# EAGLE design Adafruit ESP32-S3 TFT Feather (EAGLE 9.6.2)
COMPANY: ADAFRUIT INDUSTRIES; DRAWN: KTOWN; REV: B
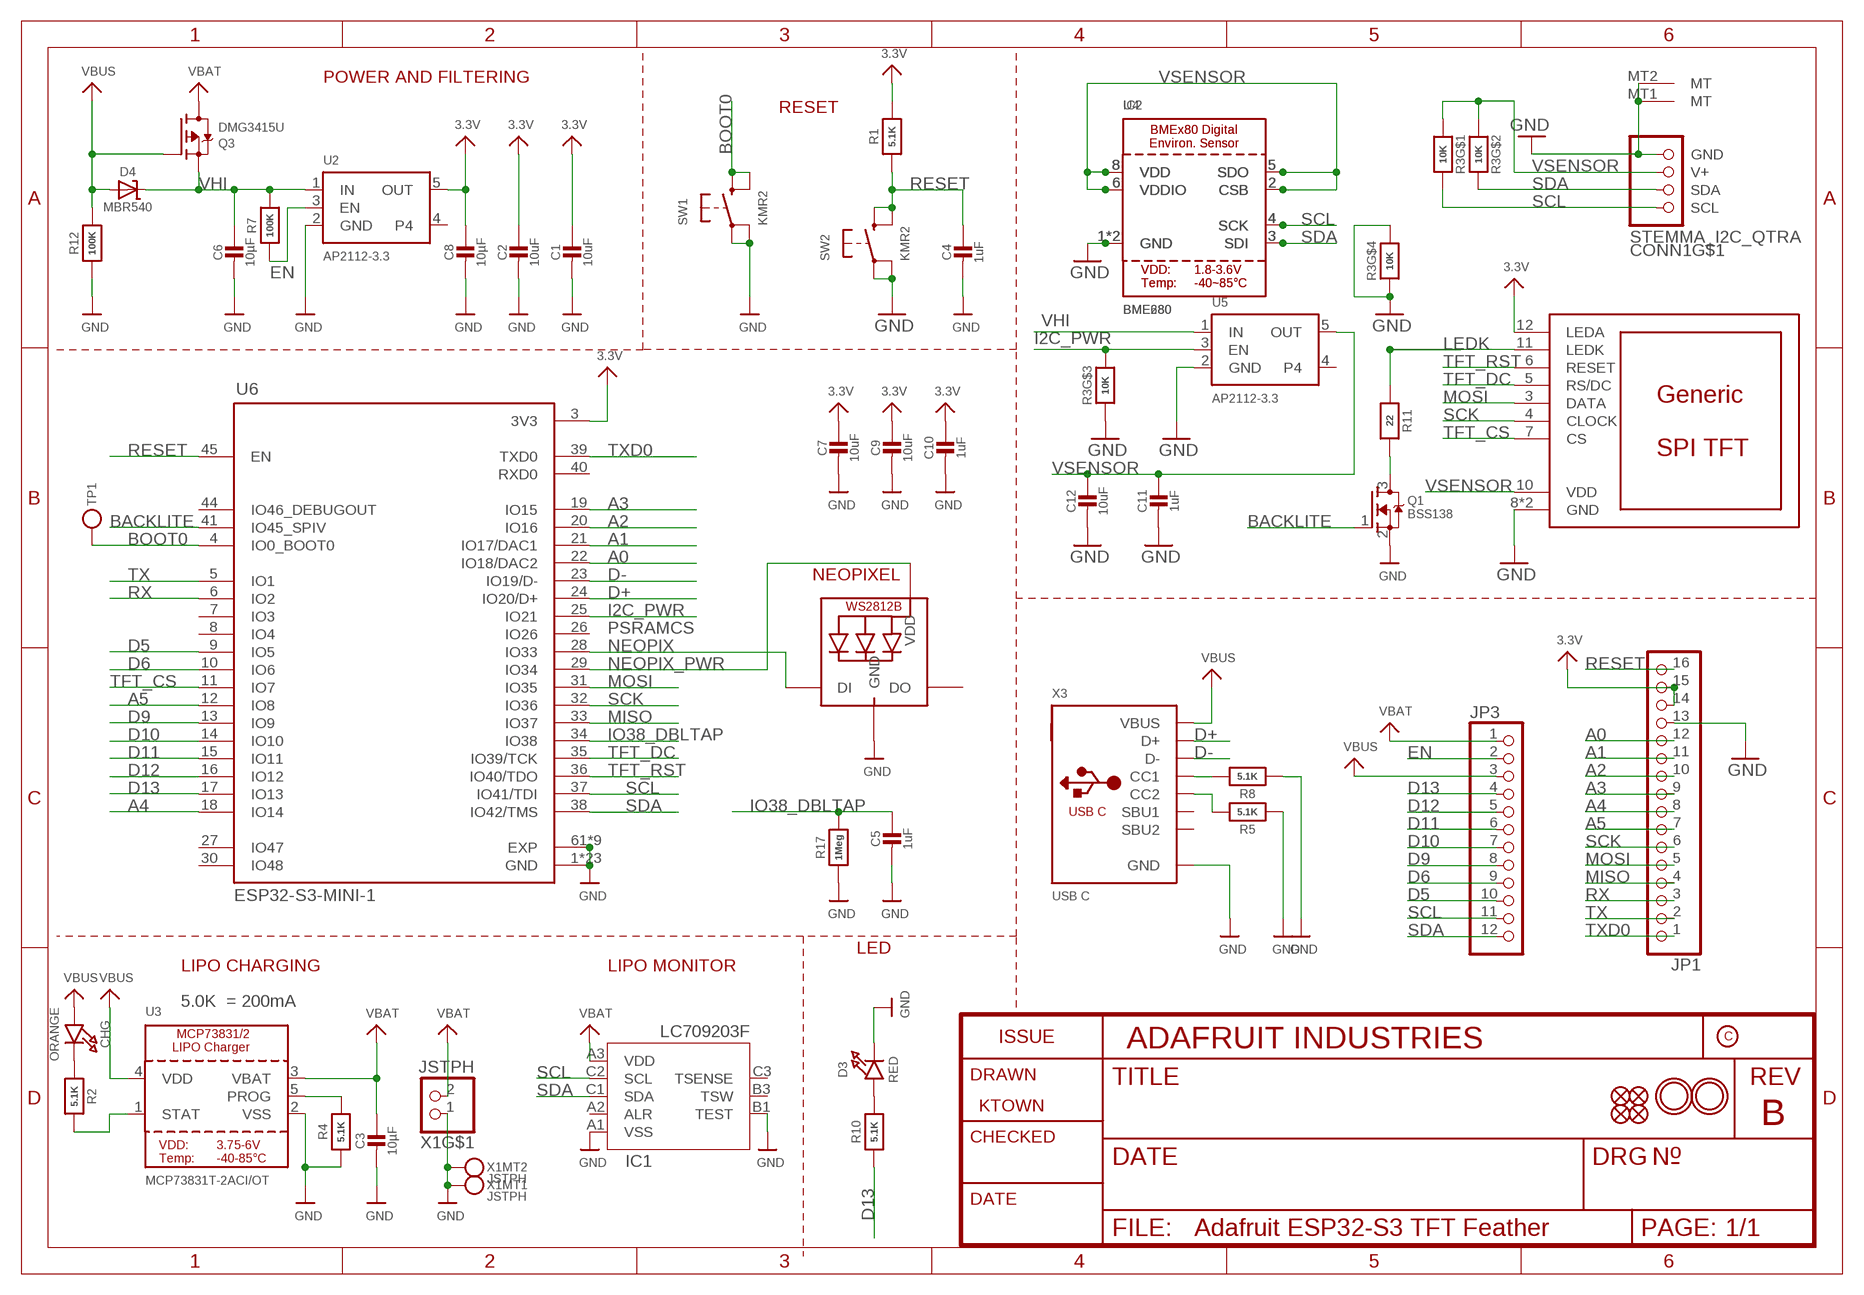
[diagram p0: schematic, sheet 1]

## Parts
C1  10uF  CAP_CERAMIC0805-NOOUTLINE  [0805-NO]
C2  10uF  CAP_CERAMIC0805-NOOUTLINE  [0805-NO]
C3  10µF  CAP_CERAMIC0805-NOOUTLINE  [0805-NO]
C4  1uF  CAP_CERAMIC0603_NO  [0603-NO]
C5  1uF  CAP_CERAMIC0603_NO  [0603-NO]
C6  10µF  CAP_CERAMIC0805-NOOUTLINE  [0805-NO]
C7  10uF  CAP_CERAMIC0805-NOOUTLINE  [0805-NO]
C8  10µF  CAP_CERAMIC0805-NOOUTLINE  [0805-NO]
C9  10uF  CAP_CERAMIC0805-NOOUTLINE  [0805-NO]
C10  1uF  CAP_CERAMIC0603_NO  [0603-NO]
C11  1uF  CAP_CERAMIC0603_NO  [0603-NO]
C12  10uF  CAP_CERAMIC0805-NOOUTLINE  [0805-NO]
CHG  ORANGE  LED0603_NOOUTLINE  [CHIPLED_0603_NOOUTLINE]
CONN1  STEMMA_I2C_QTRA  [JST_SH4_RA]
D3  RED  LED0603_NOOUTLINE  [CHIPLED_0603_NOOUTLINE]
D4  MBR540  DIODE-SCHOTTKYSOD-123  [SOD-123]
DISP1  DISP_LCD_GENERIC_SPI_1.14IN_240X135_WRAPUNDER  [TFT_1.14IN_240X135_WRAPUNDER]
IC1  LC709203F/MH  [WLCSP9]
IC2  BME680  [BME680]
JP1  HEADER-1X16_MIN  [1X16_ROUND_MIN]
JP3  HEADER-1X12_MIN  [1X12_ROUND_MIN]
LED1  WS2812B_SK6805_1515  [SK6805_1515]
Q1  BSS138  MOSFET-NREFLOW  [SOT23-R]
Q3  DMG3415U  MOSFET-P  [SOT23-R]
R1  5.1K  RESISTOR_0603_NOOUT  [0603-NO]
R2  5.1K  RESISTOR_0603_NOOUT  [0603-NO]
R3  10K  RESISTOR_4PACK  [RESPACK_4X0603]
R4  5.1K  RESISTOR_0603_NOOUT  [0603-NO]
R5  5.1K  RESISTOR_0603_NOOUT  [0603-NO]
R7  100K  RESISTOR_0603_NOOUT  [0603-NO]
R8  5.1K  RESISTOR_0603_NOOUT  [0603-NO]
R10  5.1K  RESISTOR_0603_NOOUT  [0603-NO]
R11  22  RESISTOR_0603_NOOUT  [0603-NO]
R12  100K  RESISTOR_0603_NOOUT  [0603-NO]
R17  1Meg  RESISTOR_0603_NOOUT  [0603-NO]
SW1  KMR2  SWITCH_TACT_SMT4.6X2.8  [BTN_KMR2_4.6X2.8]
SW2  KMR2  SWITCH_TACT_SMT4.6X2.8  [BTN_KMR2_4.6X2.8]
TP1  TESTPOINTROUND1.5MMNO  [TESTPOINT_ROUND_1.5MM_NO]
U2  AP2112-3.3  VREG_SOT23-5  [SOT23-5]
U3  MCP73831T-2ACI/OT  MCP73831/2  [SOT23-5]
U4  BME280  [BME280]
U5  AP2112-3.3  VREG_SOT23-5  [SOT23-5]
U6  ESP32-S3-MINI-1  [QFN60_ESP32-S2-MINI-1_EXP]
U$31  MOUNTINGHOLE2.5  [MOUNTINGHOLE_2.5_PLATED]
U$32  MOUNTINGHOLE2.5  [MOUNTINGHOLE_2.5_PLATED]
U$34  FIDUCIAL_1MM  [FIDUCIAL_1MM]
U$35  FIDUCIAL_1MM  [FIDUCIAL_1MM]
U$55  FIDUCIAL_1MM  [FIDUCIAL_1MM]
U$56  FIDUCIAL_1MM  [FIDUCIAL_1MM]
X1  JSTPH  CON_JST_PH_2PIN_MT_BATT  [JSTPH2_BATT]
X3  USB C  USB_C  [USB_C_CUSB31-CFM2AX-01-X]

## Nets
3.3V [power]: C1.1 C2.1 C7.1 C8.1 C9.1 C10.1 DISP1.12(LEDA) JP1.14 JP1.15 R1.2 U2.5(OUT) U6.3(3V3)
A0: JP1.12 U6.22(IO18/DAC2)
A1: JP1.11 U6.21(IO17/DAC1)
A2: JP1.10 U6.20(IO16)
A3: JP1.9 U6.19(IO15)
A4: JP1.8 U6.18(IO14)
A5: JP1.7 U6.12(IO8)
BACKLITE: Q1.1(G) U6.41(IO45_SPIV)
BOOT0: SW1.B'(S1) SW1.B(S) TP1.P$1 U6.4(IO0_BOOT0)
D5: JP3.10 U6.9(IO5)
D6: JP3.9 U6.10(IO6)
D9: JP3.8 U6.13(IO9)
D10: JP3.7 U6.14(IO10)
D11: JP3.6 U6.15(IO11)
D12: JP3.5 U6.16(IO12)
D13: JP3.4 R10.1 U6.17(IO13)
D+: U6.24(IO20/D+) X3.A6(D+) X3.B6(D+)
D-: U6.23(IO19/D-) X3.A7(D-) X3.B7(D-)
EN: JP3.2 R7.1 U2.3(EN)
GND: C1.2 C2.2 C3.2 C4.2 C5.2 C6.2 C7.2 C8.2 C9.2 C10.2 C11.2 C12.2 CONN1.1(GND) CONN1.MT1(MT) CONN1.MT2(MT) D3.C DISP1.8(GND) DISP1.13(GND) IC1.A1(VSS) IC1.B1(TEST) IC2.1(GND) IC2.7(GND) JP1.13 LED1.4(GND) Q1.2(S) R3.3 R3.4 R3.5 R4.1 R5.1 R8.1 R12.1 R17.1 SW1.A'(P1) SW1.A(P) SW2.A'(P1) SW2.A(P) U2.2(GND) U3.2(VSS) U4.1(GND) U4.7(GND) U5.2(GND) U6.1(GND) U6.2(GND) U6.42(GND) U6.43(GND) U6.46(GND) U6.47(GND) U6.48(GND) U6.49(GND) U6.50(GND) U6.51(GND) U6.52(GND) U6.53(GND) U6.54(GND) U6.55(GND) U6.56(GND) U6.57(GND) U6.58(GND) U6.59(GND) U6.60(GND) U6.61(EXP) U6.62(GND) U6.63(GND) U6.64(GND) U6.65(GND) U6.66(EXP) U6.67(EXP) U6.68(EXP) U6.69(EXP) U6.70(EXP) U6.71(EXP) U6.72(EXP) U6.73(EXP) X1.1 X1.NC1 X1.NC2 X3.A1B12(GND) X3.B1A12(GND)
I2C_PWR: R3.6 U5.3(EN) U6.25(IO21)
IO38_DBLTAP: C5.1 R17.2 U6.34(IO38)
LEDK: DISP1.11(LEDK) R11.1
MISO: JP1.4 U6.33(IO37)
MOSI: DISP1.3(DATA) JP1.5 U6.31(IO35)
N$1: CHG.C R2.1
N$2: Q1.3(D) R11.2
N$3: R2.2 U3.1(STAT)
N$4: R4.2 U3.5(PROG)
N$5: D3.A R10.2
N$8: R8.2 X3.A5(CC1)
N$9: R5.2 X3.B5(CC2)
NEOPIX: LED1.1(DI) U6.28(IO33)
NEOPIX_PWR: LED1.2(VDD) U6.29(IO34)
RESET: C4.1 JP1.16 R1.1 SW2.B'(S1) SW2.B(S) U6.45(EN)
RX: JP1.3 U6.6(IO2)
SCK: DISP1.4(CLOCK) JP1.6 U6.32(IO36)
SCL: CONN1.4(SCL) IC1.C2(SCL) IC2.4(SCK) JP3.11 R3.8 U4.4(SCK) U6.37(IO41/TDI)
SDA: CONN1.3(SDA) IC1.C1(SDA) IC2.3(SDI) JP3.12 R3.7 U4.3(SDI) U6.38(IO42/TMS)
TFT_CS: DISP1.7(CS) U6.11(IO7)
TFT_DC: DISP1.5(RS/DC) U6.35(IO39/TCK)
TFT_RST: DISP1.6(RESET) U6.36(IO40/TDO)
TX: JP1.2 U6.5(IO1)
TXD0: JP1.1 U6.39(TXD0)
VBAT [power]: C3.1 IC1.A3(VDD) JP3.1 Q3.3(D) U3.3(VBAT) X1.2
VBUS [power]: CHG.A D4.A JP3.3 Q3.1(G) R12.2 U3.4(VDD) X3.A4B9(VBUS) X3.B4A9(VBUS)
VHI [power]: C6.1 D4.C Q3.2(S) R7.2 U2.1(IN) U5.1(IN)
VSENSOR [power]: C11.1 C12.1 CONN1.2(V+) DISP1.10(VDD) IC2.2(CSB) IC2.5(SDO) IC2.6(VDDIO) IC2.8(VDD) R3.1 R3.2 U4.2(CSB) U4.5(SDO) U4.6(VDDIO) U4.8(VDD) U5.5(OUT)
Unconnected: IC1.A2(ALR) IC1.B3(TSW) IC1.C3(TSENSE) LED1.3(DO) U2.4 U5.4 U6.7(IO3) U6.8(IO4) U6.26(IO26) U6.27(IO47) U6.30(IO48) U6.40(RXD0) U6.44(IO46_DEBUGOUT) X3.A8(SBU1) X3.B8(SBU2)

## Notes on the sheet
- POWER AND FILTERING
- RESET
- NEOPIXEL
- PSRAMCS
- LED
- LIPO CHARGING | LIPO MONITOR
- 5.0K  = 200mA

## Library data of the parts
C1-C7 C9-C12 = microbuilder:CAP_CERAMIC: Ceramic Capacitors For new designs, use the packages preceded by an '_' character since they are more reliable: The following footprints should be used on most boards: _0402 - Standard footprint for regular board layouts _0603 - Standard footprint for regular board layouts _0805 - Standard footprint for regular board layouts _1206 - Standard footprint for regular board layouts For extremely tight-pitch boards where space is at a premium, the following 'micro-pitch' footprints can be used (smaller pads, no silkscreen outline, etc.): _0402MP - Micro-pitch footprint for very dense/compact boards _0603MP - Micro-pitch footprint for very dense/compact boards _0805MP - Micro-pitch footprint for very dense/compact boards _1206MP - Micro-pitch footprint for very dense/compact boards
C8 = microbuilder:CAP_CERAMIC: Ceramic Capacitors For new designs, use the packages preceded by an '_' character since they are more reliable: The following footprints should be used on most boards: _0402 - Standard footprint for regular board layouts _0603 - Standard footprint for regular board layouts _0805 - Standard footprint for regular board layouts _1206 - Standard footprint for regular board layouts For extremely tight-pitch boards where space is at a premium, the following 'micro-pitch' footprints can be used (smaller pads, no silkscreen outline, etc.): _0402MP - Micro-pitch footprint for very dense/compact boards _0603MP - Micro-pitch footprint for very dense/compact boards _0805MP - Micro-pitch footprint for very dense/compact boards _1206MP - Micro-pitch footprint for very dense/compact boards; REV: C
CHG D3 = microbuilder:LED: LED 0603 - 0603 Surface Mount Package 2mA: Green LED - Low Power (3.9mcd, 2ma, 1.7Vf) - Digikey: 475-2709-2-ND Orange LED - Low Power (9.8mcd, 2ma, 1.8Vf) - Digikey: 475-1194-2-ND Red LED - Low Power (5mcd, 2ma, 1.8Vf) - Digikey: 475-1195-2-ND Yellow LED - Low Power (7mcd, 2ma, 1.8Vf) - Digikey: 475-1196-2-ND 5mA: Blue LED - Low Power (17mcd, 5ma, 2.9Vf) - Digikey: LNJ937W8CRACT-ND 0805 - 0805 Surface Mount Package 2mA: Red LED (8.8mcd, 2mA, 1.8Vf, Clear) - Low Power [Digikey: 475-2510-1-ND] Green LED (5mcd, 2mA, 1.8Vf, Clear) - Low Power [Digikey: 475-2730-1-ND] Yellow LED (11.3mcd, 2mA, 1.8Vf, Clear) - Low Power [Digikey: 475-2555-1-ND] 20mA: Red LED (104mcd, 20mA, Diffused) - LS R976 [Digikey: 475-1278-6-ND] Red LED (12mcd, 20mA, 2.0Vf, Clear) - APT2012EC [Digikey: 754-1128-1-ND] Green LED (15mcd, 20mA, 2.2Vf, Clear) - APT2012GC [Digikey: 754-1131-1-ND] Orange LED (160mcd, 20mA, 2.1Vf, Clear) - APT2012SECK [Digikey: 754-1130-1-ND] 1206 - 1206 Surface Mount Package Green LED (26mcd, 20mA, Diffused) - LG N971 [Digikey: 475-1407-6-ND] Red LED (15mcd, 20mA, Diffused) - LH N974 [Digikey: 475-1416-6-ND] Cree - Cree High-Power Surface Mount LEDs XPEBWT-L1-0000-00D50 - White 111lm 350mA 2.9Vf 6200K 110° XTEAWT-00-0000-00000LEE3 - White 114lm 350mA 2.85Vf 5000K 115° Everlight - Everlight 45-21 Series Surface Mount LEDs 45-21/QK2C-B2832AC2CB2/2T - Warm White 2000mcd 20mA 3.25Vf 3050K 120° 45-21/LK2C-B38452C4CB2/2T - Nuetral White 2000mcd 20mA 3.25Vf 4150K 120° 45-21/LK2C-B50634C6CB2/2T - Cold White 2200mcd 20mA 3.25Vf 5650K 120° PLCC2 Reverse Mount LS T77K-J1L2-1-0-2-R18-Z - Red 11.25mcd 2mA 1.8Vf 630nm 120° LO T77K-L1M2-24-Z - Orange 19.6mcd 2mA 1.8Vf 606nm 120° LY T77K-K2M1-26-Z - Yellow 15.7mcd 2mA 1.8Vf 587nm 120°
CONN1 = microbuilder:STEMMA_I2C
D4 = microbuilder:DIODE-SCHOTTKY
DISP1 = adafruit_display:DISP_LCD_GENERIC_SPI
IC1 = adafruit_sensor:LC709203F
IC2 = adafruit_sensor:BME680
JP1 = microbuilder:HEADER-1X16: PIN HEADER
JP3 = microbuilder:HEADER-1X12
LED1 = microbuilder:WS2812B
Q1 = microbuilder:MOSFET-N: N-Channel Mosfet LEGEND VDS: Voltage Drain-Source ID: Drain Current RDS(ON): Drain-Source On-State Resistance VGS(TH): Gate-Source Threshold Voltage CISS: Drain-Source Input Capacitance SOT-23 Name VDS ID RDS(ON) VGS(TH) CISS Order Number 2N7002E 60V 260mA 2.5 Ohm 2.5V @ 250uA 26.7pF @ 25V 2N7002ET1GOSTR-ND BSH103 30V 850mA 400 mOhm 400mV @ 1mA 83pF @ 24V BSH103,235-ND BSS138 60V 320mA 1.6 Ohm 1.5V @ 250uA 50pF @ 10V Mouser: 771-BSS138PW115 DMN2075U-7 20V 4.2A 38 mOhm 1V @ 250 uA 594.3pF @ 10V DMN2075U-7DICT-ND * BSS138 good choice for I2C level-shifting POWERPAK 1212-8 Name VDS ID RDS(ON) VGS(TH) CISS Order Number Si7308DN 60V 6A 58 mOhm 3V @ 250uA 665pF @ 15V SI7308DN-T1-E3CT-ND
Q3 = microbuilder:MOSFET-P: P-Channel Mosfet LEGEND VDS: Voltage Drain-Source ID: Drain Current RDS(ON): Drain-Source On-State Resistance VGS(TH): Gate-Source Threshold Voltage CISS: Drain-Source Input Capacitance SOT-23 Name VDS ID RDS(ON) VGS(TH) CISS Order Number IRLML5103 30V 760mA 600 mOhm -- 75pF @ 25V Digikey: IRLML5103PBFCT-ND IRLML6401 12V 4.3A 50 mOhm 950mV @ 250µA 830pF @ 10V Digikey: IRLML6401PBFTR-ND NTR0202PL 20V 400mA 800 mOhm 2.3V @ 250uA 70pF @ 5V Digikey: NTR0202PLT1GOSTR-ND NTR4101PT1G 20V 1.8A 85 mOhm 1.2V @ 250uA 675pF @ 10V Digikey: NTR4101PT1GOSCT-ND DMP2004K 20V 600mA 900 mOhm 1V @ 250uA 175pF @ 16V Digikey: DMP2004KDICT-ND PMV65XP 20V 3.9A 76 mOhm 950mV @ 1mA 725pF @ 20V Digikey: 568-2358-2-ND TO-252 Name VDS ID RDS(ON) VGS(TH) CISS Order Number AOD417 30V 25A 34 mOhm 3V @ 250µA 920pF @ 15V Digikey: 785-1106-2-ND PowerPak Name VDS ID RDS(ON) VGS(TH) CISS Order Number AON7401 30V 12A 14 mOhm 3V @ 250µA 2600pF @ 15V Digikey: 785-1302-1-ND
R1 R2 R4 R5 R7 R8 R10-R12 R17 = microbuilder:RESISTOR: Resistors For new designs, use the packages preceded by an '_' character since they are more reliable: The following footprints should be used on most boards: _0402 - Standard footprint for regular board layouts _0603 - Standard footprint for regular board layouts _0805 - Standard footprint for regular board layouts _1206 - Standard footprint for regular board layouts For extremely tight-pitch boards where space is at a premium, the following 'micro-pitch' footprints can be used (smaller pads, no silkscreen outline, etc.): _0402MP - Micro-pitch footprint for very dense/compact boards _0603MP - Micro-pitch footprint for very dense/compact boards _0805MP - Micro-pitch footprint for very dense/compact boards _1206MP - Micro-pitch footprint for very dense/compact boards
R3 = microbuilder:RESISTOR_4PACK: Resistor Packs (4 resistors) 4 x 0603 10K 1/16W - Digikey: YC164J-10KCT-ND
SW1 SW2 = microbuilder:SWITCH_TACT_SMT: SMT Tact Switches 6x6mm - Digikey: P12940SCT-ND KMR2 (4.6x2.8mm) - Digikey: 401-1426-1-ND EVQ-PQHB55 - Light Touch, 160GF (4.5x4.5mm) - Digikey: P8090SCT-ND KMT0 - KMT021 NGJ LHS (etc.) IP68/Waterproof - Digikey: CKN10289CT-ND
TP1 = microbuilder:TESTPOINT: Test Point Various test points for characterisation and PCB testing TESTPOINT_SMT - Compact Surface Mount Test Point [Digikey: 5016KTR-ND]
U2 U5 = microbuilder:VREG_SOT23-5: SOT23-5 Fixed Voltage Regulators Part Current Out V Out V In V Dropout θJA (°C/W) TJ (°C) Digikey Part No. ADP121 150mA 3.3V 3.4-5.5V 0.09V @ 150mA -- -- ADP121-AUJZ33R7CT-ND ADP121 150mA 3.0V 3.1-5.5V 0.09V @ 150mA -- -- ADP121-AUJZ30R7CT-ND ADP122 300mA 3.3V 3.4-5.5V 0.085V @ 300mA -- -- ADP122AUJZ-3.3-R7CT-ND ADP1712 300mA 3.3V 3.5-5.5V 0.17V @ 300mA -- -- ADP1712AUJZ-3.3-R7TR-ND AP7311 (Low Cost) 150mA 3.3V 3.5-6V 0.15V @ 150mA -- -- AP7311-33WG-7DICT-ND LD39015M18R 150mA 1.8V 1.9V-5.5V 0.08V @ 100mA -- -- 497-6977-1-ND LP2985A-33DBVR 150mA 3.3V 3.3-16V 0.28V @ 150mA 206 150 296-18479-1-ND MCP1824T-3302E/OT 300mA 3.3V 3.5V-6V 0.2V @ 300mA -- -- MCP1824T-3302E/OTCT-ND MIC5205-2.5YM5 TR 150mA 2.5V 2.7-16V 0.165V @ 150mA -- -- 576-1257-2-ND MIC5205-3.0YM5 TR 150mA 3.0V 3.2V-16V 0.165V @ 150mA -- -- 576-1258-2-ND MIC5205-3.3YM5 TR 150mA 3.3V 3.5V-16V 0.165V @ 150mA -- -- 576-1259-2-ND TPS780330220 150mA 3.3V+2.2V 3.6-5.5V 250mV Max -- -- 296-23332-1-ND TDA3663/N1,135 100mA 3.3V 3.5-45V 0.18V @ 50mA -- -- 568-5343-1-ND Max operating temp can be calculated using θJA, TJ (max junction temperature), and power in watts. Set the "Maximum Ambient Temperature" until it reaches TJ ("Max Junction Temperature"), which is the absolute limit for safe use of the regulator: Heat Sink Temperature Calculator <http://www.daycounter.com/Calculators/Heat-Sink-Temperature-Calculator.phtml> For example, With 12V source into a 3.3V LP2985 and a 30mA load, we are dissipating (12V-3.3V) * 0.03A = 0.261W. With a θJA of 206 °C/W, a TJ of 150°C, and 261mW we can safely use the chip without a heat sink up to 75°C (=147.1°C Junction Temperature).
U3 = microbuilder:MCP73831/2: MCP73831/2 LIPO Charger VDD: 3.75 - 6V Temp -40 - 85°C Programmable Charge Rate: 15-500mA NOTE: STAT is a tri-state logic output on the MCP73831 and an open-drain output on the MCP73832. SOT23-5 with 4.2V output and tri-state logic on STAT = MCP73831T-2ACI/OT
U4 = adafruit_sensor:BME280: BME280 - Environmental Sensor (I2C + SPI)
U6 = adafruit_wireless:ESP32-S3-MINI-1; BUILT_BY: EMA_Kyle; COPYRIGHT: Copyright (C) 2018 Accelerated Designs. All rights reserved; DATASHEET: https://www.espressif.com/sites/default/files/documentation/esp32-s2-mini-1_esp32-s2-mini-1u_datasheet_en.pdf; MANUFACTURER_PART_NUMBER: ESP32-S2-MINI-1; SOURCELIBRARY: Add_to_database_2020-11-03; VENDOR: Espressif Systems
U$31 U$32 = microbuilder:MOUNTINGHOLE: Mounting Hole For #2 screws (0.086"/2.18mm width, 0.094"/2.4mm hole) use 2.5mm; BOM: EXCLUDE
U$34 U$35 U$55 U$56 = microbuilder:FIDUCIAL: Fiducial Alignment Points Various fiducial points for machine vision alignment.; BOM: EXCLUDE
X1 = adafruit_electromech:CON_JST_PH_2PIN_MT
X3 = adafruit_connector:USB_C: USB Type-C USB 2.0 Connector

## Net classes
2 gnd: width 0.254 mm, drill 0.483 mm
3 power: width 0.305 mm, drill 0.483 mm

## Board
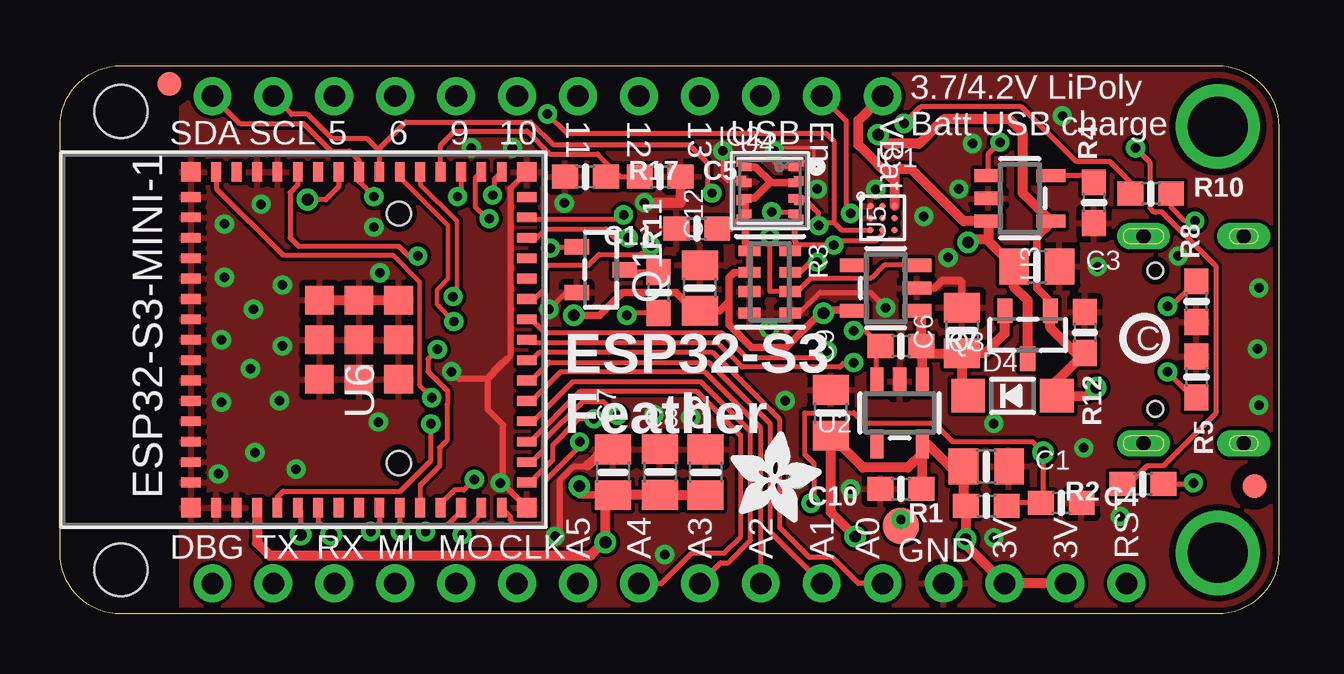
[diagram p1: board, top side]
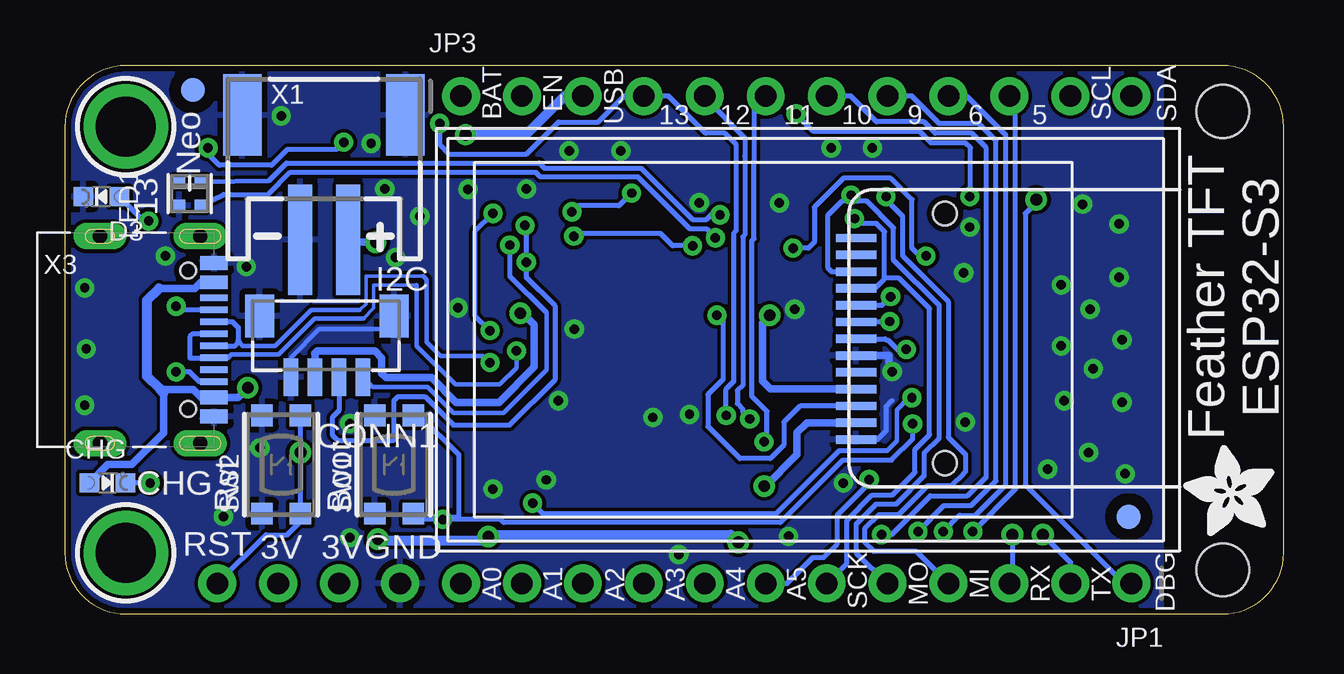
[diagram p2: board, bottom side, seen from below]

Size 50.8 x 22.86 mm. Coordinates in mm from the lower left corner, seen from the top.
Outline: 48.26,0 2.54,0 arc-90 0,2.54 0,20.32 arc-90 2.54,22.86 48.26,22.86 arc-90 50.8,20.32 50.8,2.54 arc-90 48.26,0
Copper layers (1*16): Top 0.035mm / dielectric 1.5mm / Bottom 0.035mm
Design rules "adafruit 6-6": minimum track width 6mil, minimum drill 15.5mil, track to track 6mil, track to pad 6mil, pad to pad 6mil, via to via 6mil, smd to smd 6mil, copper to edge 10mil, drill to drill 8mil, minimum pad ring 10mil, minimum via ring 8mil, stop-mask expansion 2mil, vias tented up to drill 20mil, thermal gap 10mil
Holes 2.2 mm at 2.54,1.84 2.54,20.95

### Footprints (pad centres in the part's own frame; a part is rotated, then mirrored left to right if it is on the bottom)
0805-NO = smd 1.24 x 1.5: 1 -0.95,0; 2 0.95,0
0603-NO = smd 1.075 x 1: 1 -0.85,0; 2 0.85,0
CHIPLED_0603_NOOUTLINE = smd 0.8 x 0.8: A 0,-0.75; C 0,0.75
JST_SH4_RA = smd 0.6 x 1.55: 1 1.5,1.686; 2 0.5,1.686; 3 -0.5,1.686; 4 -1.5,1.686 | smd 1.2 x 1.8: MT1 -2.8,-0.862; MT2 2.8,-0.862
SOD-123 = smd 1.4 x 1.4: A 1.85,0; C -1.85,0
TFT_1.14IN_240X135_WRAPUNDER = smd 0.35 x 1.7: 1 4.24,13.5; 2 3.54,13.5; 3 2.84,13.5; 4 2.14,13.5; 5 1.44,13.5; 6 0.74,13.5; 7 0.04,13.5; 8 -0.66,13.5; 9 -1.36,13.5; 10 -2.06,13.5; 11 -2.76,13.5; 12 -3.46,13.5; 13 -4.16,13.5 | hole 1: -5.14,9.8; 5.26,9.8
WLCSP9 = smd 0.275 x 0.275: A1 -0.5,0.5; A2 0,0.5; A3 0.5,0.5; B1 -0.5,0; B2 0,0; B3 0.5,0; C1 -0.5,-0.5; C2 0,-0.5; C3 0.5,-0.5
BME680 = smd 0.4 x 0.4: 1 1.2,1.2; 2 1.2,0.4; 3 1.2,-0.4; 4 1.2,-1.2; 5 -1.2,-1.2; 6 -1.2,-0.4; 7 -1.2,0.4; 8 -1.2,1.2
1X16_ROUND_MIN = drill 0.9 pad 1.575: 1 -19.05,0; 2 -16.51,0; 3 -13.97,0; 4 -11.43,0; 5 -8.89,0; 6 -6.35,0; 7 -3.81,0; 8 -1.27,0; 9 1.27,0; 10 3.81,0; 11 6.35,0; 12 8.89,0; 13 11.43,0; 14 13.97,0; 15 16.51,0; 16 19.05,0
1X12_ROUND_MIN = drill 0.9 pad 1.575: 1 -13.97,0; 2 -11.43,0; 3 -8.89,0; 4 -6.35,0; 5 -3.81,0; 6 -1.27,0; 7 1.27,0; 8 3.81,0; 9 6.35,0; 10 8.89,0; 11 11.43,0; 12 13.97,0
SK6805_1515 = smd 0.5 x 0.5: 1 -0.5,-0.45; 2 0.5,-0.45; 3 0.5,0.45; 4 -0.5,0.45
SOT23-R = smd 0.635 x 1.016: 1 -0.95,-1; 2 0.95,-1; 3 0,1
RESPACK_4X0603 = smd 0.45 x 0.9: 1 -1.3,-0.85; 2 -0.4,-0.85; 3 0.4,-0.85; 4 1.3,-0.85; 5 1.3,0.85; 6 0.4,0.85; 7 -0.4,0.85; 8 -1.3,0.85
BTN_KMR2_4.6X2.8 = smd 0.9 x 0.9: A 2.05,0.8; A' -2.05,0.8; B 2.05,-0.8; B' -2.05,-0.8
TESTPOINT_ROUND_1.5MM_NO = smd 1.5 x 1.5: P$1 0,0
SOT23-5 = smd 0.55 x 1.2: 1 -0.95,-1.3; 2 0,-1.3; 3 0.95,-1.3; 4 0.95,1.3; 5 -0.95,1.3
BME280 = smd 0.5 x 0.35: 1 1.025,0.975; 2 1.025,0.325; 3 1.025,-0.325; 4 1.025,-0.975; 5 -1.025,-0.975; 6 -1.025,-0.325; 7 -1.025,0.325; 8 -1.025,0.975
QFN60_ESP32-S2-MINI-1_EXP = smd 0.813 x 0.406: 1 -7,3.645; 2 -7,2.795; 3 -7,1.945; 4 -7,1.095; 5 -7,0.245; 6 -7,-0.605; 7 -7,-1.455; 8 -7,-2.305; 9 -7,-3.155; 10 -7,-4.005; 11 -7,-4.855; 12 -7,-5.705; 13 -7,-6.555; 14 -7,-7.405; 15 -7,-8.255; 31 7,-8.255; 32 7,-7.405; 33 7,-6.555; 34 7,-5.705; 35 7,-4.855; 36 7,-4.005; 37 7,-3.155; 38 7,-2.305; 39 7,-1.455; 40 7,-0.605; 41 7,0.245; 42 7,1.095; 43 7,1.945; 44 7,2.795; 45 7,3.645 | smd 0.406 x 0.813: 16 -5.95,-9.305; 17 -5.1,-9.305; 18 -4.25,-9.305; 19 -3.4,-9.305; 20 -2.55,-9.305; 21 -1.7,-9.305; 22 -0.85,-9.305; 23 0,-9.305; 24 0.85,-9.305; 25 1.7,-9.305; 26 2.55,-9.305; 27 3.4,-9.305; 28 4.25,-9.305; 29 5.1,-9.305; 30 5.95,-9.305; 46 5.95,4.695; 47 5.1,4.695; 48 4.25,4.695; 49 3.4,4.695; 50 2.55,4.695; 51 1.7,4.695; 52 0.85,4.695; 53 0,4.695; 54 -0.85,4.695; 55 -1.7,4.695; 56 -2.55,4.695; 57 -3.4,4.695; 58 -4.25,4.695; 59 -5.1,4.695; 60 -5.95,4.695 | smd 1.194 x 1.194: 61 0,-2.305; 66 -1.65,-0.655; 67 0,-0.655; 68 1.65,-0.655; 69 -1.65,-2.305; 70 1.65,-2.305; 71 -1.65,-3.955; 72 0,-3.955; 73 1.65,-3.955 | smd 0.813 x 0.813: 62 -7,4.695; 63 -7,-9.305; 64 7,-9.305; 65 7,4.695
MOUNTINGHOLE_2.5_PLATED = drill 2.5 pad 3.2: P$1 0,0
FIDUCIAL_1MM = smd 1 x 1: 1 0,0
JSTPH2_BATT = smd 1 x 4.6: 1 -1,-3.7; 2 1,-3.7 | smd 1.6 x 3.4: NC1 -3.4,1.5; NC2 3.4,1.5
USB_C_CUSB31-CFM2AX-01-X = smd 0.575 x 1.15: A1B12 -3.2,3.545; A4B9 -2.4,3.545; B1A12 3.2,3.545; B4A9 2.4,3.545 | smd 0.275 x 1.15: A5 -1.25,3.545; A6 -0.25,3.545; A7 0.25,3.545; A8 1.25,3.545; B5 1.75,3.545; B6 0.75,3.545; B7 -0.75,3.545; B8 -1.75,3.545 | drill 0.6 pad 1 long: M1 -4.32,2.97; M2 4.32,2.97; M3 -4.32,-1.21; M4 4.32,-1.21 | hole 0.65: 2.89,2.47; -2.89,2.47

### Placement (x,y rotation side)
C1  38.61,6.15 0 top
C2  26.91,5.91 90 top
C3  40.72,14.48 0 top
C4  41.73,4.62 0 top
C5  25.02,18.22 0 top
C6  37.6,11.82 90 top
C7  23.05,5.91 90 top
C8  25.02,5.91 90 top
C9  32.13,8.38 90 top
C10  35.05,5.21 180 top
C11  26.54,16.07 180 top
C12  26.67,13.59 90 top
CHG  49.02,5.46 270 bottom
CONN1  39.88,11.56 180 bottom
D3  49.28,17.4 90 bottom
D4  39.7,9.09 0 top
DISP1  4.32,11.43 90 bottom
IC1  34.29,16.51 0 top
IC2  29.59,17.65 0 top
JP1  25.4,1.27 180 bottom
JP3  20.32,21.59 0 bottom
LED1  45.59,17.53 90 bottom
Q1  22.54,14.35 270 top
Q3  40.34,11.63 180 top
R1  38.61,4.51 180 top
R2  45.14,5.41 180 top
R3  29.59,13.84 270 top
R4  43.1,17.14 90 top
R5  47.37,9.88 270 top
R7  35.05,11.16 0 top
R8  47.37,13.02 90 top
R10  45.47,17.53 0 top
R11  24.96,13.4 90 top
R12  42.72,11.73 270 top
R17  21.91,18.22 0 top
SW1  37.08,6.22 90 bottom
SW2  41.78,6.22 90 bottom
TP1  35.05,3.67 180 top
U2  35,8.38 180 top
U3  40.01,17.32 270 top
U4  29.59,17.65 0 top
U5  34.42,13.59 90 top
U6  10.16,11.43 90 top
U$7  [PCBFEAT-REV-040]  45.21,11.49 0 top
U$9  [ADAFRUIT_3.5MM]  0.38,3.24 90 bottom
U$31  48.26,20.32 270 bottom
U$32  48.26,2.54 270 bottom
U$34  45.47,21.84 270 bottom
U$35  6.46,4.05 270 bottom
U$54  [ADAFRUIT_3.5MM]  27.94,3.81 0 top
U$55  49.78,5.33 0 top
U$56  4.57,22.1 0 top
X1  40.01,19.3 0 bottom
X3  48.13,11.43 270 bottom

### Tracks (layer width: path | path; a pad name or v marks a point on that pad's centre or on a via)
3.3V  (via drill 0.48, 0.5)
  Top 0.305: v21.65,5.32 21.65,4.96 C7.1
  Top 0.406: U6.3 8.21,2.96 8.74,2.44 22.12,2.44 22.67,2.98 v22.73,2.98 22.73,4.64 C7.1 C8.1 C2.1 | C10.1 35.95,5.26 U2.5 | U2.5 36.15,7.08 37.09,6.15 C1.1 37.66,4.61 R1.2 v37.76,3.11 37.76,2.88 JP1.14 JP1.15 | U2.5 35.95,6.7 35.35,6.1 33.47,6.1 C9.1 32.13,4.24 v33.15,3.22
  Bottom 0.305: v21.65,5.32 21.65,5.28 20.28,6.65 20.28,7.56 19.87,7.97 DISP1.12
  Bottom 0.406: v22.73,2.98 23.05,3.3 33.06,3.3 v33.15,3.22 33.15,3.05 37.69,3.05 v37.76,3.11
A0
  Top 0.203: JP1.12 33.27,1.27 32.19,2.35 31.25,2.35 30.01,3.58 30.01,8.1 27.21,10.9 19.97,10.9 19.66,10.58 U6.22
A1
  Top 0.203: U6.21 19.63,9.73 20.39,10.49 27.05,10.49 29.6,7.93 29.6,3.42 JP1.11
A2
  Top 0.203: JP1.10 29.21,7.75 26.88,10.08 20.86,10.08 19.66,8.88 U6.20
A3
  Top 0.203: JP1.9 27.53,2.13 27.85,2.13 28.79,3.07 28.79,7.6 26.71,9.68 21.37,9.68 19.72,8.03 U6.19
A4
  Top 0.203: JP1.8 25.08,1.27 26.35,2.54 27.69,2.54 28.38,3.24 28.38,7.43 26.54,9.27 21.68,9.27 19.59,7.18 U6.18
A5  (via drill 0.39)
  Top 0.203: U6.12 15.87,4.58 16.44,5.16 16.83,5.16 v17.27,5.61
  Bottom 0.203: v17.27,5.61 17.27,5.46 18.61,4.13 18.61,2.92 19.18,2.35 19.62,2.35 20.7,1.27 JP1.7
BACKLITE  (via drill 0.39)
  Top 0.203: U6.41 9.91,17.91 9.58,17.57 9.58,15.69 9.94,15.33 14.12,15.33 14.53,14.92 v14.91,14.92 | v20.45,15.25 20.5,15.3 Q1.1
  Bottom 0.203: v14.91,14.92 15.16,14.92 15.49,15.25 15.49,17.28 16.38,18.16 18.35,18.16 19.56,16.95 19.56,15.5 19.81,15.25 v20.45,15.25
BOOT0  (via drill 0.39)
  Top 0.203: U6.4 9.06,4.87 9.31,5.12 14.18,5.12 15.46,6.4 v15.46,7.92 | TP1.P$1 v35.05,3.94
  Bottom 0.203: SW1.B 36.03,8.27 34.38,6.62 34.38,4.05 36.16,4.05 SW1.B' 36.05,3.94 v35.05,3.94 32.64,3.94 32.51,3.81 20.98,3.81 18.38,6.41 16.34,6.41 15.46,7.29 v15.46,7.92
D5  (via drill 0.39)
  Top 0.203: U6.9 13.31,3.79 v12.95,3.43
  Bottom 0.203: v12.95,3.43 11.18,5.21 11.18,21.34 JP3.10
D6  (via drill 0.39)
  Top 0.203: U6.10 14.16,3.45 v14.19,3.43
  Bottom 0.203: v14.19,3.43 13.51,4.11 12.85,4.11 11.58,5.38 11.58,19.96 13.21,21.59 JP3.9
D9  (via drill 0.39)
  Top 0.203: v15.24,3.43 15.49,3.68 16.13,3.68 16.71,4.27 U6.13
  Bottom 0.203: v15.24,3.43 14.15,4.51 13.02,4.51 11.99,5.54 11.99,19.74 12.7,20.45 14.35,20.45 15.49,21.59 JP3.8
D10  (via drill 0.39)
  Top 0.203: U6.14 17.57,4.18 16.76,3.38 v16.76,3.3
  Bottom 0.203: v16.76,3.3 16.35,3.3 14.73,4.92 13.19,4.92 12.39,5.71 12.39,19.44 12.99,20.04 14.52,20.04 15,20.52 16.97,20.52 18.03,21.59 JP3.7
D11  (via drill 0.39)
  Top 0.203: v21.66,7.18 21.66,6.99 20.2,5.52 20.2,3.75 20.2,3.74 18.94,3.74 18.78,3.91 18.78,4.07 U6.15
  Bottom 0.203: JP3.6 22.07,21.11 22.07,18.92 22.07,15.65 22.16,15.56 22.16,9.07 21.53,8.45 21.53,7.3 v21.66,7.18
D12  (via drill 0.39)
  Top 0.203: v22.26,8.13 21.62,8.13 20.55,7.05 20.55,6.43 19.59,5.48 U6.16
  Bottom 0.203: JP3.5 24.13,21.53 22.45,19.84 22.45,19.08 22.45,19.07 22.45,15.81 22.54,15.72 22.54,9.53 22.77,9.31 22.77,8.77 22.55,8.55 22.55,8.43 v22.26,8.13
D13  (via drill 0.39)
  Top 0.203: U6.17 19.66,6.33 20.16,6.84 20.16,7.24 21.77,8.85 22.66,8.85 v23.23,8.27 | R10.1 44.62,18 43.75,18.86 42.35,18.86 40.07,21.14 35.87,21.14 v35.18,20.45
  Bottom 0.203: v35.18,20.45 35.18,19.56 34.8,19.18 31.56,19.18 30.23,20.51 28.57,20.51 27.5,21.59 JP3.4 25.64,21.59 24.09,20.04 23.28,20.04 22.84,19.59 22.84,15.96 22.92,15.88 22.92,9.69 23.26,9.35 23.26,8.3 v23.23,8.27
D+  (via drill 0.39)
  Top 0.203: U6.24 19.66,12.28 20.23,11.71 27.6,11.71 28.62,10.69 31.71,10.69 v31.98,10.97
  Bottom 0.152: 36.13,13.72 37.93,13.72 37.93,12.75 38.36,12.32
  Bottom 0.178: X3.B6 44,10.68 43.87,10.81 42.53,10.81 42.52,10.82 41.88,10.82 40.38,12.32 38.36,12.32 | 36.13,13.72 36.13,11.18 34.51,9.56 32.68,9.56 31.98,10.26 v31.98,10.97
  Bottom 0.203: X3.B6 44.58,10.67 45.59,10.67 45.59,11.56 45.47,11.68 X3.A6
D-  (via drill 0.39)
  Top 0.203: U6.23 19.59,11.3 27.4,11.3 28.42,10.29 32.51,10.29 32.7,10.48 v33.08,10.48
  Bottom 0.152: 35.88,14.1 38.25,14.1 38.25,12.93 38.51,12.68
  Bottom 0.178: 43.57,11.43 43.55,11.4 43.55,11.33 43.39,11.18 42.03,11.18 40.53,12.68 38.51,12.68 | v33.08,10.48 33.37,10.76 35.14,10.76 35.72,11.34 35.72,13.94 35.88,14.1
  Bottom 0.203: X3.A7 43.7,11.18 43.57,11.31 43.57,11.43 43.57,11.95 43.8,12.18 X3.B7
EN  (via drill 0.39)
  Top 0.203: U2.3 34.01,9.72 34.01,10.97 R7.1 33.55,11.81 v33.08,11.81 | JP3.2 32.77,20.57 32.77,16.89 v32.96,16.7
  Bottom 0.203: v32.96,16.7 33.72,15.94 33.72,12.45 v33.08,11.81
GND  (via drill 0.39)
  Top 0.152: v27.62,19.3 27.62,18.22 27.81,18.03 27.83,18.05 IC2.7 28.47,17.98 U4.7 | IC2.1 30.62,18.68 U4.1 29.99,18.63 29.97,18.61 29.78,18.8 v29.78,19.3 29.91,19.43 31.43,19.43 31.43,18.86 IC2.1
  Top 0.203: Q1.2 21.08,13.4 v20.38,12.7 | v34.42,12.76 33.78,13.4 31.69,13.4 30.83,12.54 R3.5
  Top 0.254: v16.32,10.1 16.64,9.79 17.84,9.79 17.84,8.51 18.48,7.87 18.48,5.42 U6.63 | 22,6.2 21.93,6.12 21.38,6.12 20.83,5.57 20.83,3.43 v20.64,3.24 | 20.85,18.43 R17.1 | 30.29,11.88 30.29,11.81 | U6.64 18.78,17.74 18.78,10.78 18.35,10.35
  Top 0.305: 18.62,10.62 18.35,10.35 17.84,9.84 | U5.2 36.45,13.59 36.77,13.91 37.53,13.91 37.6,13.83 C6.2
  Top 0.406: v24.36,17.14 25.87,17.14 C5.2 | C7.2 22.66,6.86 22,6.2 | U6.68 U6.70 U6.73
  Bottom 0.178: CONN1.MT1 37.62,11.87 40.2,11.87 41.38,10.69 CONN1.1
  Bottom 0.203: DISP1.13 16.93,7.27 16.73,7.47 16.72,7.47 16.57,7.62 16.57,8.64 16.32,8.89
  Bottom 0.305: DISP1.8 16.45,10.77 16.45,10.23 v16.32,10.1
  other vias: 36,16.57 18.86,19.43 38.04,19.62 43.24,14.48 42.67,6.92 44.2,4.06 26.29,8.19 24.77,8.32 30.73,5.59 32.96,5.21 38.93,3.17 38.93,7.94 46.61,14.92 49.97,13.59 49.97,8.7 49.91,11.05 6.6,5.84 6.73,8.83 6.73,11.43 6.86,14.03 6.86,16.26 8.38,17.08 9.27,13.72 9.27,11.18 9.14,8.89 8.13,6.73 7.94,10.22 8.06,12.7 13.27,8 13.08,16.13 13.34,14.22 17.14,19.43 9.84,6.03 34,17.7 21.02,17.13 30.23,8.89 37.47,17.72 18.35,5.46 25.21,2.48 41.78,20.76 29.57,11.87 31.56,17.72 37.02,14.86
  pour Top: 50.8,0 5.08,0 5.08,22.86 50.8,22.86
  pour Bottom: 50.8,0 5.08,0 5.08,22.86 50.8,22.86
I2C_PWR  (via drill 0.39)
  Top 0.203: U5.3 34.35,14.54 33.82,14.01 31.3,14.01 30.74,13.44 R3.6 29.61,13.44 29.59,13.46 v29.59,15.75 | U6.25 19.78,13.13 20.16,13.51 20.16,14.35 20.36,14.54 22.04,14.54 22.48,14.99 24.17,14.99 24.22,15.04 24.33,15.04 v24.64,15.35
  Bottom 0.203: v24.64,15.35 25.46,15.35 25.99,15.88 29.46,15.88 v29.59,15.75
IO38_DBLTAP
  Top 0.203: U6.34 15.87,19.55 16.45,20.13 19.46,20.13 20.42,19.18 22.42,19.18 23.37,18.22 C5.1 R17.2
LEDK  (via drill 0.39)
  Top 0.203: R11.1 23.72,12.55 v23.62,12.45
  Bottom 0.203: v23.62,12.45 23.37,12.2 23.37,9.78 24,9.15 24,7.81 22.67,6.48 21.4,6.48 20.83,7.05 20.83,8 20.16,8.67 DISP1.11
MISO  (via drill 0.39)
  Top 0.203: U6.33 16.71,17.54 v16.57,17.4 | v16.57,17.4
  Bottom 0.203: JP1.4 15.3,2.6 17.08,2.6 17.44,2.96 17.44,3.58 16.9,4.13 16.07,4.13 14.86,5.33 13.84,5.33 13.34,5.84 13.34,5.86 13.26,5.94 13.26,6.64 13.98,7.36 13.98,13.02 15.88,14.92 15.88,16.57 16.57,17.27 v16.57,17.4
MOSI  (via drill 0.39)
  Top 0.203: U6.31 18.1,18.11 18.1,17.46 v18.03,17.46
  Bottom 0.203: JP1.5 16.54,1.27 17.82,2.55 17.82,3.74 16.99,4.57 16.16,4.57 14.99,5.75 14.99,6.7 14.36,7.33 14.36,12.86 16.26,14.76 16.26,16.1 17.37,17.21 17.78,17.21 | 17.78,17.21 v18.03,17.46 | DISP1.3 18.84,14.27 18.99,14.41 18.99,16.64 18.41,17.21 17.78,17.21
N$1  (via drill 0.39)
  Top 0.203: R2.1 47.19,5.41 v47.24,5.46
  Bottom 0.203: v47.24,5.46 CHG.C
N$2
  Top 0.203: R11.2 23.64,14.25 Q1.3
N$3  (via drill 0.39)
  Top 0.203: U3.1 38.7,19.19 v39.18,19.67 | R2.2 44.55,5.41 45.33,6.19 46,6.19 48.2,8.38 48.2,14.48 45.93,16.75 45.66,16.75 45.65,16.76 45.59,16.76 45.45,16.91 45.45,18.82 v44.83,19.43
  Bottom 0.203: v39.18,19.67 39.48,19.37 41.53,19.37 42.19,18.7 44.36,18.7 44.83,19.18 v44.83,19.43
N$4
  Top 0.203: R4.2 42.83,18.27 U3.5
N$5  (via drill 0.39)
  Top 0.203: R10.2 46.32,16.95 46.89,16.38 v47.31,16.38
  Bottom 0.203: D3.A 47.51,16.38 v47.31,16.38
N$8  (via drill 0.39)
  Top 0.203: v46.16,12.83 46.25,12.74 R8.2
  Bottom 0.203: X3.A5 46.02,12.68 v46.16,12.83
N$9  (via drill 0.39)
  Top 0.203: v46.16,10.09 47.22,9.03 R5.2
  Bottom 0.203: X3.B5 45.18,9.68 45.59,10.09 v46.16,10.09
NEOPIX  (via drill 0.39)
  Top 0.203: v23.69,15.68 23.11,15.68 22.75,16.05 20.24,16.05 19.75,15.56 19.59,15.56 U6.28
  Bottom 0.203: LED1.1 44.19,17.48 42.33,17.48 41.4,18.41 31.18,18.41 30.99,18.22 26.92,18.22 24.77,16.07 24.07,16.07 v23.69,15.68
NEOPIX_PWR  (via drill 0.39)
  Top 0.203: v23.5,16.64 23.3,16.44 19.55,16.44 U6.29
  Bottom 0.203: LED1.2 42.28,18.08 41.56,18.8 31.02,18.8 30.81,18.59 26.78,18.59 24.64,16.45 24.07,16.45 23.81,16.7 23.56,16.7 v23.5,16.64
RESET  (via drill 0.39, 0.5)
  Top 0.178: v15.49,9.02 14.99,9.52 14.99,13.84 13.88,14.95
  Top 0.203: R1.1 39.57,4.62 C4.1 40.98,4.72 v40.98,6.73 40.54,7.18 37.21,7.18 36.42,7.96 33.5,7.96 33.08,8.38 31.05,8.38 31.05,6.65 31.43,6.27 31.43,4.74 v31.3,4.62 | U6.45 6.51,17.74 9.3,14.95 13.88,14.95
  Bottom 0.178: 16.52,6.82 16.13,7.2 16.13,8.51 15.62,9.02 v15.49,9.02
  Bottom 0.203: JP1.16 42.42,3.3 41.53,3.3 40.98,3.85 SW2.B' v40.98,6.73 SW2.B | v31.3,4.62 30.88,4.19 21.14,4.19 18.52,6.82 16.52,6.82
RX  (via drill 0.5)
  Top 0.203: U6.6 10.77,3.84 v11.3,3.3
  Bottom 0.203: v11.3,3.3 11.3,1.4 JP1.3
SCK  (via drill 0.39)
  Top 0.203: U6.32 17.31,18.18 17.31,16.97 17.76,16.52 17.76,16.48 v17.89,16.48
  Bottom 0.203: JP1.6 18.2,2.12 18.2,3.9 17.15,4.95 16.32,4.95 15.37,5.9 15.37,6.86 14.76,7.47 14.76,12.73 16.04,14 16.64,14 | v17.89,16.48 17.7,16.29 16.99,16.29 16.64,15.94 16.64,14 | 16.64,14 16.64,13.97 17.04,13.57 DISP1.4
SCL  (via drill 0.39)
  Top 0.152: IC2.4 30.62,16.63 U4.4
  Top 0.203: U6.37 13.31,19.3 | 13.31,19.3 13.31,19.41 14.41,20.51 19.62,20.51 20.57,19.56 26.22,19.56 26.99,18.79 26.99,17.74 v27.18,17.55 | 13.31,19.3 12.81,19.81 11.33,19.81 10.32,20.83 9.65,20.83 JP3.11 | U4.4 30.62,15.54 30.77,15.38 v32.26,15.38 32.45,15.57 34.04,15.57 34.29,15.82 IC1.C2 | v29.66,16.76 30.53,16.76 U4.4 | R3.8 30.63,15.33 30.63,16.66 U4.4
  Bottom 0.178: 30.73,12.57 30.73,10.16 32.51,8.38 34.61,8.38 35.69,9.46 37.97,9.46 CONN1.4
  Bottom 0.203: v32.26,15.38 32.26,14.1 30.73,12.57 | v27.18,17.55 27.7,17.02 29.41,17.02 v29.66,16.76
SDA  (via drill 0.39)
  Top 0.152: U4.3 30.69,17.25 IC2.3
  Top 0.203: JP3.12 7.49,20.45 10.16,20.45 11.3,19.3 12.06,19.3 12.46,18.9 U6.38 12.46,18.02 v13.08,17.4 | v20.32,20.85 21.13,20.04 31.93,20.04 32.26,19.71 32.26,16.32 | 32.26,16.32 32.57,16.01 IC1.C1 | 32.26,16.32 31.75,16.32 v31.62,16.19 31.62,16.7 31,17.33 U4.3 | R3.7 30.85,14.24 31.28,14.67 v31.57,14.67
  Bottom 0.203: v13.08,17.4 13.06,17.42 13.06,19.43 13.26,19.63 14.69,19.63 15.17,20.12 19.59,20.12 v20.32,20.85 | CONN1.3 39.38,8.47 39.63,8.22 39.63,7.44 39.43,7.24 37.08,7.24 37.08,8.89 36.92,9.06 35.79,9.06 34.61,7.87 32.26,7.87 30.35,9.78 30.35,12.83 31.57,14.04 v31.57,14.67 31.57,16.14 v31.62,16.19
TFT_CS  (via drill 0.39)
  Top 0.203: v15.72,11.03 15.33,10.63 15.33,10.1 16.15,9.29 16.15,8.75 16.13,8.73 16.13,7.24 15.82,6.93 15.82,6.17 15.02,5.36 U6.11
  Bottom 0.203: DISP1.7 16.62,11.47 16.56,11.41 16.49,11.41 15.92,10.84 v15.72,11.03
TFT_DC  (via drill 0.39)
  Top 0.178: v16.38,13.23 16.54,13.39 16.54,16.37 15.02,17.9
  Top 0.203: U6.35 15.02,17.9
  Bottom 0.203: DISP1.5 16.74,12.87 v16.38,13.23
TFT_RST  (via drill 0.39)
  Top 0.178: 14.16,18.21 16.19,16.19 16.19,13.98 15.72,13.51 15.72,12.89 v16.41,12.19
  Top 0.203: U6.36 14.16,18.21
  Bottom 0.203: v16.41,12.19 16.44,12.17 DISP1.6
TX  (via drill 0.5)
  Top 0.203: U6.5 10.03,4.31 v10.03,3.3
  Bottom 0.203: v10.03,3.3 8.89,2.16 JP1.2
TXD0  (via drill 0.5)
  Top 0.203: U6.39 11.62,17.81 11.08,17.27 v10.32,17.27
  Bottom 0.203: v10.32,17.27 10.32,17.14 10.77,16.69 10.77,5.37 6.67,1.27 JP1.1
VBAT  (via drill 0.48)
  Top 0.305: 37.97,15.62 v37.85,15.49
  Top 0.406: Q3.3 40.34,13.07 39.77,13.64 C3.1 38.7,15.54 | 38.7,15.54 38.62,15.62 37.97,15.62 | 38.7,15.54 U3.3 37.67,16.37 35.5,18.54 34.8,18.54 34.8,18.03 | JP3.1 33.27,20.57 33.27,19.56 34.8,18.03 | IC1.A3 34.8,18.03
  Bottom 0.305: v37.85,15.49 38.9,15.49 X1.2
VBUS  (via drill 0.48)
  Top 0.305: Q3.1 41.28,13.03 40.73,13.59 40.73,15.69 41.3,16.26 U3.4
  Top 0.406: Q3.1 41.28,11.93 42.33,10.88 R12.2 41.55,9.71 D4.A 42.84,9.09 v43.18,9.43 | U3.4 40.15,17.53 40.13,17.53 40.13,20.07 39.58,20.62 36.83,20.62 35.81,19.6 34.48,19.6 v34.1,19.98
  Bottom 0.305: 46.81,9.35 45.45,9.35 45.13,9.03 X3.B4A9 43.58,9.03 v43.18,9.43 | 46.88,13.58 45.38,13.58 45.11,13.84 44.6,13.84 X3.A4B9 | CHG.A 49.01,6.22 48.01,6.22 46.69,7.54 46.69,9.22
  Bottom 0.406: 46.88,13.58 47.37,13.08 47.37,9.91 46.81,9.35 46.69,9.22 | v34.1,19.98 31.58,19.98 29.97,21.59 JP3.3
VHI
  Top 0.406: C6.1 37.6,9.34 D4.C | U2.1 35.95,11.11 R7.2 | R7.2 36.2,10.87 C6.1 | Q3.2 39.37,12.62 39.37,11.68 38.55,10.87 C6.1 | R7.2 35.9,12.45 U5.1
VSENSOR  (via drill 0.48)
  Top 0.305: U4.6 28.95,17.33 29.6,17.98 29.65,17.98 | U4.6 U4.5 | 29.65,17.98 29,18.63 U4.8 28.57,18.68 IC2.8 | v21.42,12.45 22.49,12.45 23.44,13.39 25.68,13.39 26.44,12.64 C12.1 27.5,12.64 27.88,13.02 | U4.5 28.57,15.47 28.74,15.3 R3.1 R3.2 28.09,14.24 27.88,14.03 27.88,13.02 | U5.5 33.09,12.66 31.95,12.66 v31.82,12.54 31.68,12.54 30.26,11.11 28.83,11.11 27.88,12.06 27.88,13.02 | 29.65,17.98 U4.2 30.72,17.98 IC2.2 | U4.5 27.95,16.07 C11.1 | IC2.6 28.49,17.25 U4.6 | U4.5 28.39,16.5 IC2.5
  Bottom 0.305: CONN1.2 40.38,10.85 40.39,10.86 40.29,10.95 37.88,10.95 37.59,10.67 37.59,10.03 37.41,9.86 35.52,9.86 34.49,8.83 32.7,8.83 31.24,10.29 31.24,12.06 31.71,12.54 v31.82,12.54 | DISP1.10 21.38,9.37 21.73,9.72 21.73,12.13 v21.42,12.45

### Text on the board
tPlace: 11 | 12 | 13 | En | VBat | 3.7/4.2V LiPoly / Batt USB charge | SDA | SCL | 5 | 6 | 9 | 10 | USB | ESP32-S3 / Feather | DBG | TX | RX | MI | MO | CLK | GND | A5 | A4 | A3 | A2 | A1 | A0 | 3V | 3V | RST
bPlace: SDA | SCL | USB | EN | BAT | 5 | 6 | 9 | 10 | 11 | 12 | 13 | Neo | 13 | Feather TFT / ESP32-S3 | I2C | Boot | Rst | CHG | GND | 3V | 3V | RST | DBG | TX | RX | MI | MO | SCK | A5 | A4 | A3 | A2 | A1 | A0